# Altium schematic sheet AMS_Control_2.SchDoc: Control Circuit 2
size A4; CheckedBy: Àlex Sánchez i Benet; DrawnBy: Àlex Sánchez i Benet; DocumentNumber: 1; Revision: 1; SheetNumber: 4; SheetTotal: 5; University: UPC EEBE; City: Barcelona; Country: Spain; CP: 08019; Address: Av. Eduard Maristany, 16
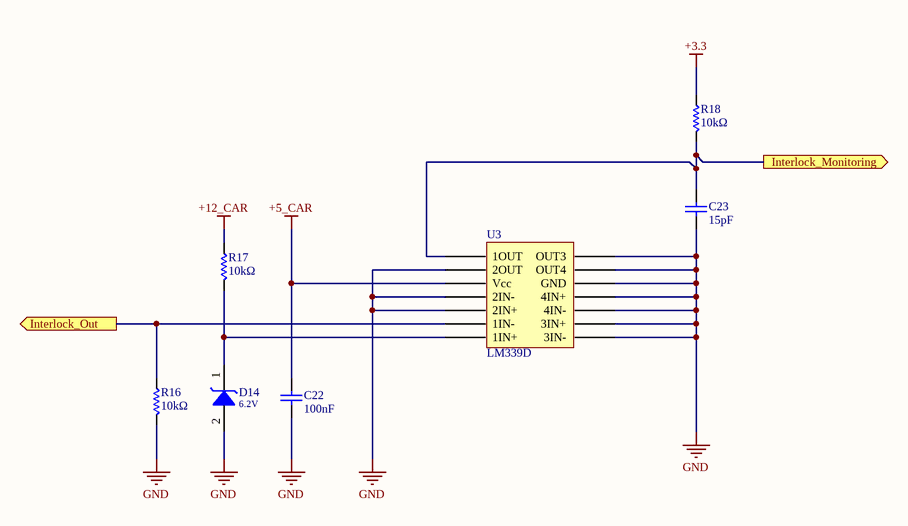
[diagram p0: AMS_Control_2.SchDoc]

## Parts
C22  100nF  [0805_2x1.25x0.8mm_Reflow Soldering]
C23  15pF  [0805_2x1.25x0.6mm_Reflow Soldering]
D14  6.2V  [BZG05C-M-Series]
R16  10kΩ  [CR0805]
R17  10kΩ  [CR0805]
R18  10kΩ  [CR0805]
U3  LM339D  [LM339D]

## Ports
Interlock_Monitoring (out), Interlock_Out (out)

## Nets
+3.3: R18.2
+5_CAR: C22.2 U3.3(Vcc)
+12_CAR: R17.2
GND: C22.1 C23.1 D14.2(A) R16.1 U3.2(2OUT) U3.4(2IN-) U3.5(2IN+) U3.8(3IN-) U3.9(3IN+) U3.10(4IN-) U3.11(4IN+) U3.12(GND) U3.13(OUT4) U3.14(OUT3)
Interlock_Monitoring: C23.2 R18.1 U3.1(1OUT) ; port Interlock_Monitoring
Interlock_Out: R16.2 U3.6(1IN-) ; port Interlock_Out
NetD14_1: D14.1(K) R17.1 U3.7(1IN+)

## Notes on the sheet
- Title
- e-Tech Racing
- UPC EEBE
- Size:
- Date:
- Drawn by:
- A4
- Number:
- Time:
- Revision:
- Sheet
- of
- Av. Eduard Maristany, 16
- 08019
- Barcelona Spain
- Made with:
- Checked by:

## Library data of the parts
C22 = 885012207098: WCAP-CSGP Ceramic Capacitors, 0805, X7R, 50V, 100nF; Rated Voltage: 50V DC; ComponentLink1Description: Manufacturer; ComponentLink1URL: http://www.we-online.de; ComponentLink2Description: Datasheet; ComponentLink2URL: http://katalog.we-online.de/pbs/datasheet/885012207098.pdf; Part Number: 885012207098; Publisher: Wurth Elektronik; Size: 0805; Operating Temperature: -55 °C to +125 °C; Value: 100nF; Ceramic Type: X7R
C23 = 885012007052: WCAP-CSGP Ceramic Capacitors, 0805, NP0, 50V, 15pF; Rated Voltage: 50V DC; ComponentLink1Description: Manufacturer; ComponentLink1URL: http://www.we-online.de; ComponentLink2Description: Datasheet; ComponentLink2URL: http://katalog.we-online.de/pbs/datasheet/885012007052.pdf; Part Number: 885012007052; Published Date: Oct. 2017; Publisher: Wurth Elektronik; Size: 0805; Operating Temperature: -55 °C to +125 °C; Value: 15pF; Ceramic Type: NP0
D14 = BZG05C6V2-E3-TR: Zener Diode; Manufacturer: Vishay; ComponentLink1Description: Datasheet; ComponentLink1URL: http://www.vishay.com/docs/86135/bzg05c-m-series.pdf
R16-R18 = CR0805-JW-103ELF: Chip Resistor 0805; Manufacturer: Bourns; ComponentLink1Description: Datasheet; ComponentLink1URL: https://www.bourns.com/docs/product-datasheets/chpreztr.pdf?sfvrsn=566c91f1_11
U3 = LM339D: Quad Differential / Comparators; Manufacturer: Texas Instrument; Pins: 14; ComponentLink1Description: Datasheet; ComponentLink1URL: http://www.ti.com/lit/ds/symlink/lm339.pdf